# EasyEDA schematic ShieldHeltec_WS.json
TITLE: ShieldHeltec_WS; REV: 1.0; Date: 08-07-2023; Sheet: 1/1; Company: www.fpagano.com
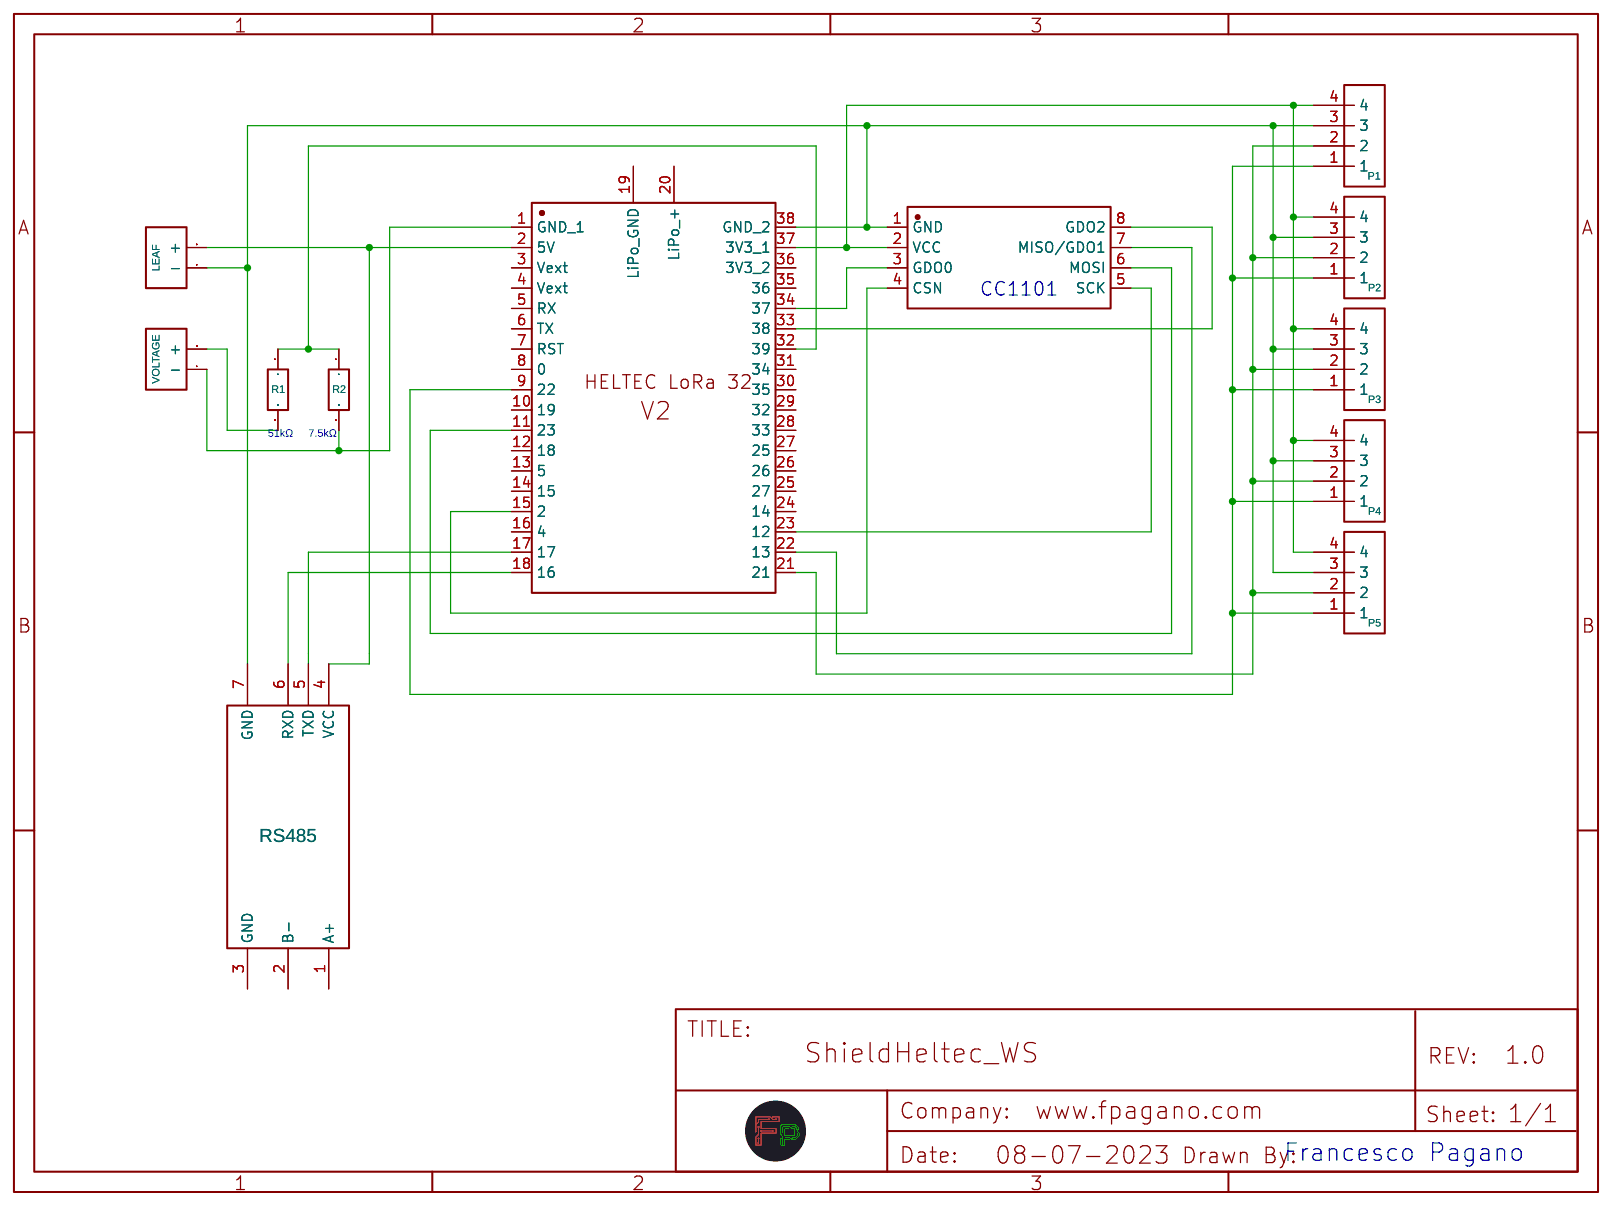
[diagram p0: schematic sheet]

## Parts
CC1_  CC1101 Module  [CC1101-BOARS]
LEAF  Foglia  [CONN-TH_2P-P5.00]
P1  Header 4 Pin 2.54mm  [PIN_HEADER_FEMALE_4PIN]
P2  Header 4 Pin 2.54mm  [PIN_HEADER_FEMALE_4PIN]
P3  Header 4 Pin 2.54mm  [PIN_HEADER_FEMALE_4PIN]
P4  Header 4 Pin 2.54mm  [PIN_HEADER_FEMALE_4PIN]
P5  Header 4 Pin 2.54mm  [PIN_HEADER_FEMALE_4PIN]
R1  R1  [R_AXIAL-0.5]
R2  R2  [R_AXIAL-0.5]
U2  HELTEC_LORA_ESP32_V2  [HELTEC_LORA_32_FF]
U4  RS485  [RS485 TO TTL 5V 3.3V]
VOLTAGE  Foglia  [CONN-TH_2P-P5.00]

## Library data of the parts
CC1_ = CC1101 Module: link: https://de.aliexpress.com/item/1005002603843028.html?spm=a2g0o.order_list.order_list_main.4.33755c5fdlCHfO&gatewayAdapt=glo2deu; Contributor: mkohns
LEAF VOLTAGE = CONN-TH_2P-P5.00: Supplier: LCSC; Contributor: LCEDA_Lib
P1-P5 = Pin_Header_Female_4PIN: Contributor: rowzun
R1 R2 = R_AXIAL-0.5_EU: Contributor: LCEDA_Lib
U2 = HELTEC_LORA_ESP32_V2: Manufacturer Part: WIFI LoRa 32; Supplier Part: WIFI LoRa 32; Supplier: HELTEC; link: http://www.heltec.cn/project/wifi-lora-32/; Contributor: jccpanadero
U4 = 01.RS485 TO TTL 5V 3.3V: Contributor: javacong

## Nets
Net-(CC1_-1): CC1_.1(GND) LEAF.1(-) P1.3 P2.3 P3.3 P4.3 P5.3 U2.38(GND_2) U4.7(GND)
Net-(CC1_-2): CC1_.2(VCC) P1.4 P2.4 P3.4 P4.4 P5.4 U2.37(3V3_1)
Net-(CC1_-3): CC1_.3(GDO0) U2.34(37)
Net-(CC1_-4): CC1_.4(CSN) U2.15(2)
Net-(CC1_-5): CC1_.5(SCK) U2.23(12)
Net-(CC1_-6): CC1_.6(MOSI) U2.11(23)
Net-(CC1_-7): CC1_.7(MISO/GDO1) U2.22(13)
Net-(CC1_-8): CC1_.8(GDO2) U2.33(38)
Net-(LEAF-2): LEAF.2(+) U2.2(5V) U4.4(VCC)
Net-(P1-1): P1.1 P2.1 P3.1 P4.1 P5.1 U2.9(22)
Net-(P1-2): P1.2 P2.2 P3.2 P4.2 P5.2 U2.21
Net-(R1-1): R1.1 R2.1 U2.32(39)
Net-(R1-2): R1.2 VOLTAGE.2(+)
Net-(R2-2): R2.2 U2.1(GND) VOLTAGE.1(-)
Net-(U2-17): U2.17 U4.5(TXD)
Net-(U2-18): U2.18(16) U4.6(RXD)

Not connected (* = marked no-connect by the designer): U2 3(Vext) 4(Vext) 5(RX) 6(TX) 7(RST) 8(0) 10(19) 12(18) 13(5) 14(15) 16(4) 19(LiPo GND) 20(LiPo +) 24(14) 25(27) 26 27(25) 28(33) 29(32) 30(35) 31(34) 35(36) 36(3V3_2); U4 1(A+) 2(B-) 3(GND)

## Notes on the sheet
- CC1101
- 51kΩ
- 7.5kΩ
- Francesco Pagano
